# EAGLE design grabber-sensor (EAGLE 7.2.0)

## Sheet 1 of 12
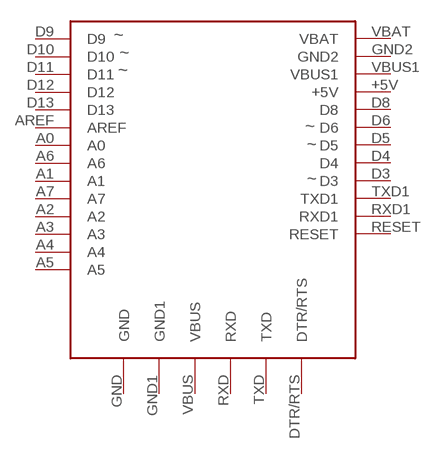
[diagram p0: schematic, sheet 1]

### Parts
U1_0_BRAIN  ADAFRUIT-PRO-TRINKET-5V-BOB  [ADAFRUIT-PRO-TRINKET-5V]

### Nets
+5V_0_BRAIN: U1_0_BRAIN.+5V ; also sheet 3,10
A0_0_BRAIN: U1_0_BRAIN.A0 ; also sheet 11
A1_0_BRAIN: U1_0_BRAIN.A1 ; also sheet 12
A2_0_BRAIN: U1_0_BRAIN.A2 ; also sheet 3
A3_0_BRAIN: U1_0_BRAIN.A3
A4_0_BRAIN: U1_0_BRAIN.A4
A5_0_BRAIN: U1_0_BRAIN.A5
A6_0_BRAIN: U1_0_BRAIN.A6
A7_0_BRAIN: U1_0_BRAIN.A7
AREF_0_BRAIN: U1_0_BRAIN.AREF
D3_0_BRAIN: U1_0_BRAIN.D3 ; also sheet 5
D4_0_BRAIN: U1_0_BRAIN.D4 ; also sheet 7
D5_0_BRAIN: U1_0_BRAIN.D5 ; also sheet 6
D6_0_BRAIN: U1_0_BRAIN.D6 ; also sheet 10
D8_0_BRAIN: U1_0_BRAIN.D8 ; also sheet 10
D9_0_BRAIN: U1_0_BRAIN.D9 ; also sheet 10
D10_0_BRAIN: U1_0_BRAIN.D10 ; also sheet 10
D11_0_BRAIN: U1_0_BRAIN.D11 ; also sheet 10
D12_0_BRAIN: U1_0_BRAIN.D12 ; also sheet 10
D13_0_BRAIN: U1_0_BRAIN.D13 ; also sheet 10
DTR/RTS_0_BRAIN: U1_0_BRAIN.DTR/RTS
GND_0_BRAIN: U1_0_BRAIN.GND U1_0_BRAIN.GND1 U1_0_BRAIN.GND2 ; also sheet 2,3,5,6,7,10,11,12
POS_1_BATTERY: U1_0_BRAIN.VBAT ; also sheet 2,5,6,10
RESET_0_BRAIN: U1_0_BRAIN.RESET
RXD1_0_BRAIN: U1_0_BRAIN.RXD1
RXD_0_BRAIN: U1_0_BRAIN.RXD
TXD1_0_BRAIN: U1_0_BRAIN.TXD1
TXD_0_BRAIN: U1_0_BRAIN.TXD
VBUS1_0_BRAIN: U1_0_BRAIN.VBUS1
VBUS_0_BRAIN: U1_0_BRAIN.VBUS

## Sheet 2 of 12
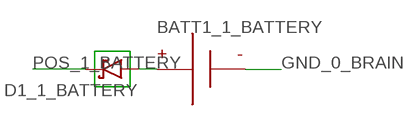
[diagram p1: schematic, sheet 2]

### Parts
BATT1_1_BATTERY  BATTERY-9V-VERTICAL  [BATTERY_9V_KEYSTONE_968]
D1_1_BATTERY  RESOLVED-DIODE-SCHOTTKY_TH-DO-41-AND-DO-204AL  [DIOAD1125W78L520D270_HS]

### Nets
GND_0_BRAIN: BATT1_1_BATTERY.N ; also sheet 1,3,5,6,7,10,11,12
N$1_1_BATTERY: BATT1_1_BATTERY.P D1_1_BATTERY.A
POS_1_BATTERY: D1_1_BATTERY.C ; also sheet 1,5,6,10

## Sheet 3 of 12
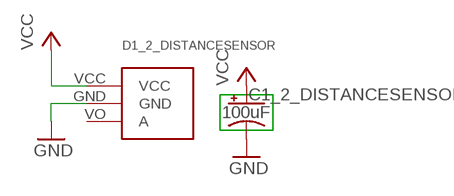
[diagram p2: schematic, sheet 3]

### Parts
C1_2_DISTANCESENSOR  100uF  RESOLVED-CAPACITOR-POL_TH-RADIAL_ALUMINUM_6.3MM  [CAPPRD250W80D630H1220P]
D1_2_DISTANCESENSOR  ANALOG_DISTANCE_SENSOR-GLUE  [ANALOG_DISTANCE_SENSOR_GLUE_MOUNT]

### Nets
+5V_0_BRAIN: C1_2_DISTANCESENSOR.1(+) D1_2_DISTANCESENSOR.VCC ; supply symbol labelled VCC ; also sheet 1,10
A2_0_BRAIN: D1_2_DISTANCESENSOR.VO(A) ; also sheet 1
GND_0_BRAIN: C1_2_DISTANCESENSOR.2(-) D1_2_DISTANCESENSOR.GND ; supply symbol labelled GND ; also sheet 1,2,5,6,7,10,11,12

## Sheet 4 of 12
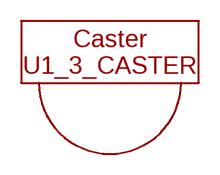
[diagram p3: schematic, sheet 4]

### Parts
U1_3_CASTER  CASTERADAFRUIT-3/4IN  [ADAFRUIT-3/4IN-CASTER]

## Sheet 5 of 12
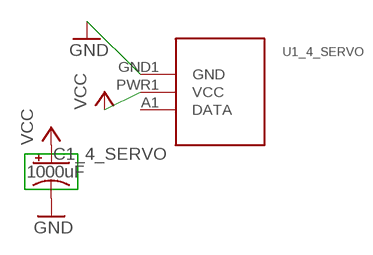
[diagram p4: schematic, sheet 5]

### Parts
C1_4_SERVO  1000uF  RESOLVED-CAPACITOR-POL_TH-RADIAL_ALUMINUM_10MM  [CAPPRD500W80D1000H2200P]
U1_4_SERVO  SERVO-MICRO_SIDE_GLUE  [SERVO_MICRO_SIDE_GLUE]

### Nets
D3_0_BRAIN: U1_4_SERVO.A1(DATA) ; also sheet 1
GND_0_BRAIN: C1_4_SERVO.2(-) U1_4_SERVO.GND1(GND) ; supply symbol labelled GND ; also sheet 1,2,3,6,7,10,11,12
POS_1_BATTERY: C1_4_SERVO.1(+) U1_4_SERVO.PWR1(VCC) ; supply symbol labelled VCC ; also sheet 1,2,6,10

## Sheet 6 of 12
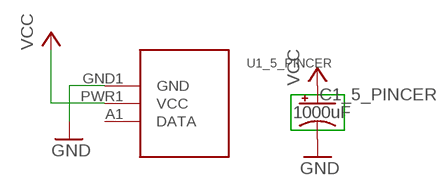
[diagram p5: schematic, sheet 6]

### Parts
C1_5_PINCER  1000uF  RESOLVED-CAPACITOR-POL_TH-RADIAL_ALUMINUM_10MM  [CAPPRD500W80D1000H2200P]
U1_5_PINCER  MICRO_GRIPPER  [MICRO_GRIPPER]

### Nets
D5_0_BRAIN: U1_5_PINCER.A1(DATA) ; also sheet 1
GND_0_BRAIN: C1_5_PINCER.2(-) U1_5_PINCER.GND1(GND) ; supply symbol labelled GND ; also sheet 1,2,3,5,7,10,11,12
POS_1_BATTERY: C1_5_PINCER.1(+) U1_5_PINCER.PWR1(VCC) ; supply symbol labelled VCC ; also sheet 1,2,5,10

## Sheet 7 of 12
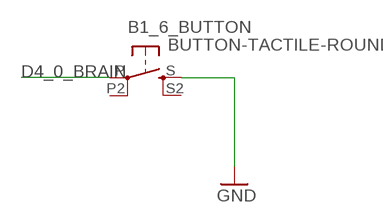
[diagram p6: schematic, sheet 7]

### Parts
B1_6_BUTTON  BUTTON-TACTILE-ROUND  [BUTTON-TACTILE-ROUND-ADAFRUIT1009]

### Nets
D4_0_BRAIN: B1_6_BUTTON.P ; also sheet 1
GND_0_BRAIN: B1_6_BUTTON.S ; supply symbol labelled GND ; also sheet 1,2,3,5,6,10,11,12
Unconnected: B1_6_BUTTON.P2(P1) B1_6_BUTTON.S2(S1)

## Sheet 8 of 12
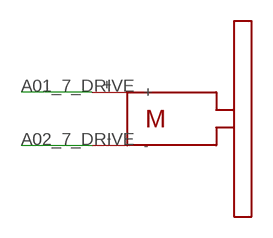
[diagram p7: schematic, sheet 8]

### Parts
R_7_DRIVE  SOLARBOTICS_GM2SPARKFUN_HOBBY  [SPARKFUN_HOBBY_MOTOR]

### Nets
A01_7_DRIVE: R_7_DRIVE.+ ; also sheet 10
A02_7_DRIVE: R_7_DRIVE.- ; also sheet 10

## Sheet 9 of 12
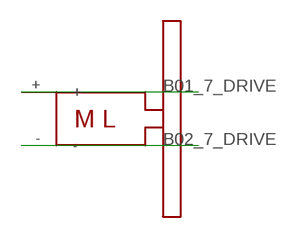
[diagram p8: schematic, sheet 9]

### Parts
L_7_DRIVE  SOLARBOTICS_GM2_LEFTSPARKFUN_HOBBY  [SPARKFUN_HOBBY_MOTOR_LEFT]

### Nets
B01_7_DRIVE: L_7_DRIVE.+ ; also sheet 10
B02_7_DRIVE: L_7_DRIVE.- ; also sheet 10

## Sheet 10 of 12
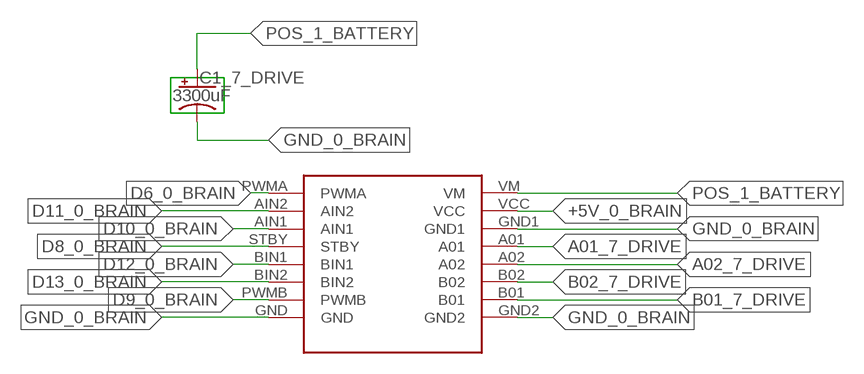
[diagram p9: schematic, sheet 10]

### Parts
C1_7_DRIVE  3300uF  RESOLVED-CAPACITOR-POL_TH-RADIAL_ALUMINUM_16MM  [CAPPRD750W80D1600H2200P]
DRVR_7_DRIVE  SPARKFUN_DUAL_MOTOR_DRIVER-BOB  [SPARKFUN_DUAL_MOTOR_DRIVER]

### Nets
+5V_0_BRAIN: DRVR_7_DRIVE.VCC ; also sheet 1,3
A01_7_DRIVE: DRVR_7_DRIVE.A01 ; also sheet 8
A02_7_DRIVE: DRVR_7_DRIVE.A02 ; also sheet 8
B01_7_DRIVE: DRVR_7_DRIVE.B01 ; also sheet 9
B02_7_DRIVE: DRVR_7_DRIVE.B02 ; also sheet 9
D6_0_BRAIN: DRVR_7_DRIVE.PWMA ; also sheet 1
D8_0_BRAIN: DRVR_7_DRIVE.STBY ; also sheet 1
D9_0_BRAIN: DRVR_7_DRIVE.PWMB ; also sheet 1
D10_0_BRAIN: DRVR_7_DRIVE.AIN1 ; also sheet 1
D11_0_BRAIN: DRVR_7_DRIVE.AIN2 ; also sheet 1
D12_0_BRAIN: DRVR_7_DRIVE.BIN1 ; also sheet 1
D13_0_BRAIN: DRVR_7_DRIVE.BIN2 ; also sheet 1
GND_0_BRAIN: C1_7_DRIVE.2(-) DRVR_7_DRIVE.GND DRVR_7_DRIVE.GND1 DRVR_7_DRIVE.GND2 ; also sheet 1,2,3,5,6,7,11,12
POS_1_BATTERY: C1_7_DRIVE.1(+) DRVR_7_DRIVE.VM ; also sheet 1,2,5,6

## Sheet 11 of 12
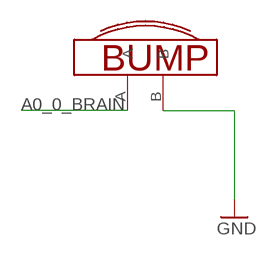
[diagram p10: schematic, sheet 11]

### Parts
U$2_8_BUMP  BUMP_SWITCH-MEDIUM-LEFT  [BUMP_SWITCH_OMRON_D2FLA]

### Nets
A0_0_BRAIN: U$2_8_BUMP.A ; also sheet 1
GND_0_BRAIN: U$2_8_BUMP.B ; supply symbol labelled GND ; also sheet 1,2,3,5,6,7,10,12

## Sheet 12 of 12
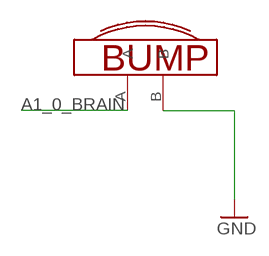
[diagram p11: schematic, sheet 12]

### Parts
U$2_9_BUMP_2  BUMP_SWITCH-MEDIUM-RIGHT  [BUMP_SWITCH_OMRON_D2FLA1]

### Nets
A1_0_BRAIN: U$2_9_BUMP_2.A ; also sheet 1
GND_0_BRAIN: U$2_9_BUMP_2.B ; supply symbol labelled GND ; also sheet 1,2,3,5,6,7,10,11

## Library data of the parts
B1_6_BUTTON = Components:BUTTON-TACTILE; DIST: Adafruit; DISTPN: 1009; HIERARCHY_NAME: button.B1
BATT1_1_BATTERY = Components:BATTERY; HIERARCHY_NAME: battery.BATT1
C1_2_DISTANCESENSOR = KoalaBuild:RESOLVED-CAPACITOR-POL_: Polarized capacitor; DATASHEET: http://industrial.panasonic.com/www-cgi/jvcr13pz.cgi?E+PZ+3+ABA0012+ECA1EM101+7+WW; DB: /Users/swanson/research/NVSL/src/with-git/gtron_devel/Gadgets/Tools/Koala/Koala/PartLibrary/Digikey/Capacitors-AluminumTH.csv; DEVICE: TH-RADIAL_ALUMINUM_6.3MM; DIST: Digikey; DISTPN: P5152-ND; HIERARCHY_NAME: distanceSensor.C1; IMAGE: http://media.digikey.com/Photos/Panasonic%20Photos/ECA-1EM101B.JPG; MFR: Panasonic Electronic Components; MIN_QTY: 1; MPN: ECA-1EM101; PACKAGE: CAPPRD250W80D630H1220P; PRICE: $0.25; SIZE: TH; STOCK: STOCK; TOL: 20%; VALUE_QUERY: >10uF; VOLTS: ( >= 5)V
C1_4_SERVO = KoalaBuild:RESOLVED-CAPACITOR-POL_: Polarized capacitor; DATASHEET: http://industrial.panasonic.com/www-cgi/jvcr13pz.cgi?E+PZ+3+ABA0012+ECA1EM102+7+WW; DB: /Users/swanson/research/NVSL/src/with-git/gtron_devel/Gadgets/Tools/Koala/Koala/PartLibrary/Digikey/Capacitors-AluminumTH.csv; DEVICE: TH-RADIAL_ALUMINUM_10MM; DIST: Digikey; DISTPN: P5156-ND; HIERARCHY_NAME: Servo.C1; IMAGE: http://media.digikey.com/Photos/Panasonic%20Photos/ECA-1AM102B.JPG; MFR: Panasonic Electronic Components; MIN_QTY: 1; MPN: ECA-1EM102; PACKAGE: CAPPRD500W80D1000H2200P; PRICE: $0.68; SIZE: TH; STOCK: STOCK; TOL: 20%; VALUE_QUERY: > 1000uF; VOLTS: ( >= 5)V
C1_5_PINCER = KoalaBuild:RESOLVED-CAPACITOR-POL_: Polarized capacitor; DATASHEET: http://industrial.panasonic.com/www-cgi/jvcr13pz.cgi?E+PZ+3+ABA0012+ECA1EM102+7+WW; DB: /Users/swanson/research/NVSL/src/with-git/gtron_devel/Gadgets/Tools/Koala/Koala/PartLibrary/Digikey/Capacitors-AluminumTH.csv; DEVICE: TH-RADIAL_ALUMINUM_10MM; DIST: Digikey; DISTPN: P5156-ND; HIERARCHY_NAME: Pincer.C1; IMAGE: http://media.digikey.com/Photos/Panasonic%20Photos/ECA-1AM102B.JPG; MFR: Panasonic Electronic Components; MIN_QTY: 1; MPN: ECA-1EM102; PACKAGE: CAPPRD500W80D1000H2200P; PRICE: $0.68; SIZE: TH; STOCK: STOCK; TOL: 20%; VALUE_QUERY: >1000uF; VOLTS: ( >= 5)V
C1_7_DRIVE = KoalaBuild:RESOLVED-CAPACITOR-POL_: Polarized capacitor; DATASHEET: http://industrial.panasonic.com/www-cgi/jvcr13pz.cgi?E+PZ+3+ABA0012+ECA1EM332+7+WW; DB: /Users/swanson/research/NVSL/src/with-git/gtron_devel/Gadgets/Tools/Koala/Koala/PartLibrary/Digikey/Capacitors-AluminumTH.csv; DEVICE: TH-RADIAL_ALUMINUM_16MM; DIST: Digikey; DISTPN: P5158-ND; HIERARCHY_NAME: drive.C1; IMAGE: http://media.digikey.com/Photos/Panasonic%20Photos/ECA-1CM472.jpg; MFR: Panasonic Electronic Components; MIN_QTY: 1; MPN: ECA-1EM332; PACKAGE: CAPPRD750W80D1600H2200P; PRICE: $1.13; SIZE: TH; STOCK: STOCK; TOL: 20%; VALUE_QUERY: >3000uF; VOLTS: ( >= 5)V
D1_1_BATTERY = KoalaBuild:RESOLVED-DIODE-SCHOTTKY_: Schottky diode; DATASHEET: http://www.st.com/web/en/resource/technical/document/datasheet/CD00001625.pdf; DB: /Users/swanson/research/NVSL/src/with-git/gtron_devel/Gadgets/Tools/Koala/Koala/PartLibrary/Digikey/Schottky-Diodes-TH.csv; DEVICE: TH-DO-41-AND-DO-204AL; DIST: Digikey; DISTPN: 497-4547-1-ND; HIERARCHY_NAME: battery.D1; IMAGE: http://media.digikey.com/photos/STMicro%20Photos/1N5819.JPG; IRECT: 1A; MFR: STMicroelectronics; MIN_QTY: 1; MPN: 1N5817; PACKAGE: DIOAD1125W78L520D270_HS; PRICE: $0.57; SIZE: TH; STOCK: STOCK; VALUE: 450mV; VREV: 20V
D1_2_DISTANCESENSOR = Components:ANALOG_DISTANCE_SENSOR; DIST: Pololu; DISTPN: 2450; HIERARCHY_NAME: distanceSensor.D1
DRVR_7_DRIVE = BOBs:SPARKFUN_DUAL_MOTOR_DRIVER: SF Dual Motor Driver; DIST: Sparkfun; DISTPN: 9457; HIERARCHY_NAME: drive.DRVR
L_7_DRIVE = Components:SOLARBOTICS_GM2_LEFT; HIERARCHY_NAME: drive.L
R_7_DRIVE = Components:SOLARBOTICS_GM2; HIERARCHY_NAME: drive.R
U1_0_BRAIN = BOBs:ADAFRUIT-PRO-TRINKET-5V: Adafruit Pro Trinket - 5V 16MHz; DIST: Adafruit; DISTPN: 2000; HIERARCHY_NAME: brain.U1
U1_3_CASTER = Components:CASTER; DIST: Adafruit; DISTPN: 1200; HIERARCHY_NAME: caster.u1
U1_4_SERVO = Components:SERVO: SM-S3317SR - Small Servo Continuous Rotation By SpringRC Technical Specifications: VCC: 4.8-6V Speed at 4.8V: 68 RPM Torque at 4.8V: 1.4 kg-cm (16.48 oz-in) Speed at 6V: 86 RPM Torque at 6V: 1.7 kg-cm (23.65 oz-in) Weight: 19g (0.67oz); DIST: Sparkfun; DISTPN: 9065; HIERARCHY_NAME: Servo.U1
U1_5_PINCER = Components:MICRO_GRIPPER; HIERARCHY_NAME: Pincer.U1
U$2_8_BUMP = Components:BUMP_SWITCH; DIST: Digikey; DISTPN: SW843-ND; HIERARCHY_NAME: bump.U$2
U$2_9_BUMP_2 = Components:BUMP_SWITCH; DIST: Digikey; DISTPN: SW842-ND; HIERARCHY_NAME: bump_2.U$2

## Board
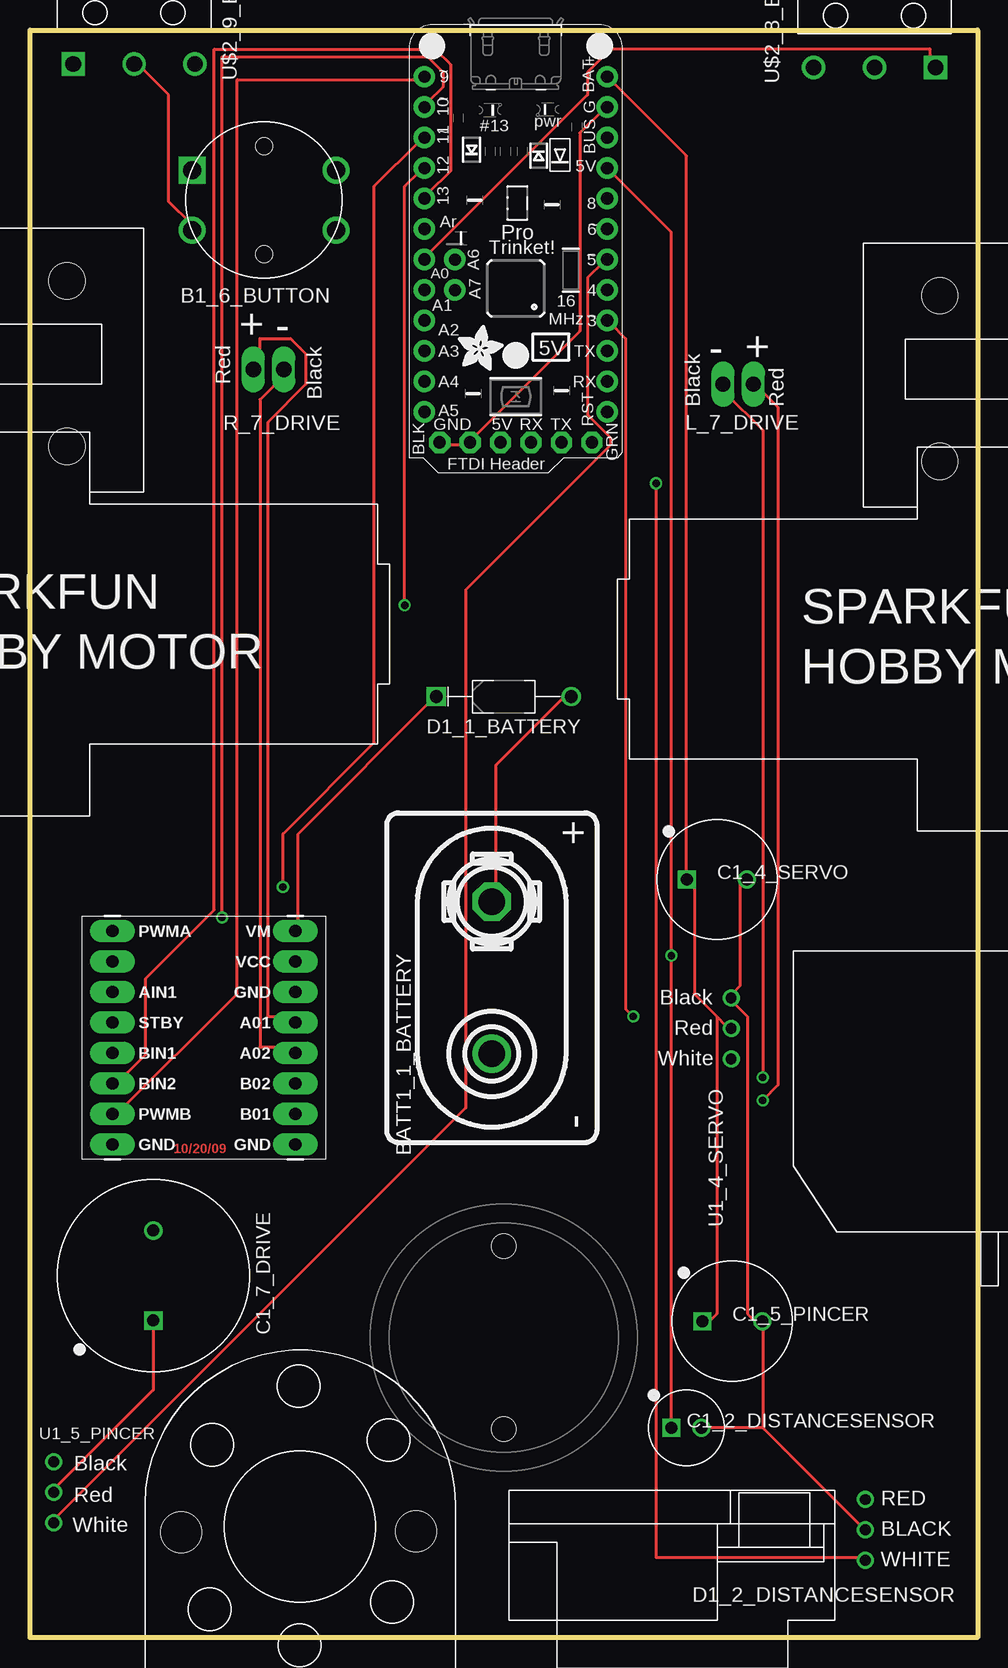
[diagram p12: board, top side]
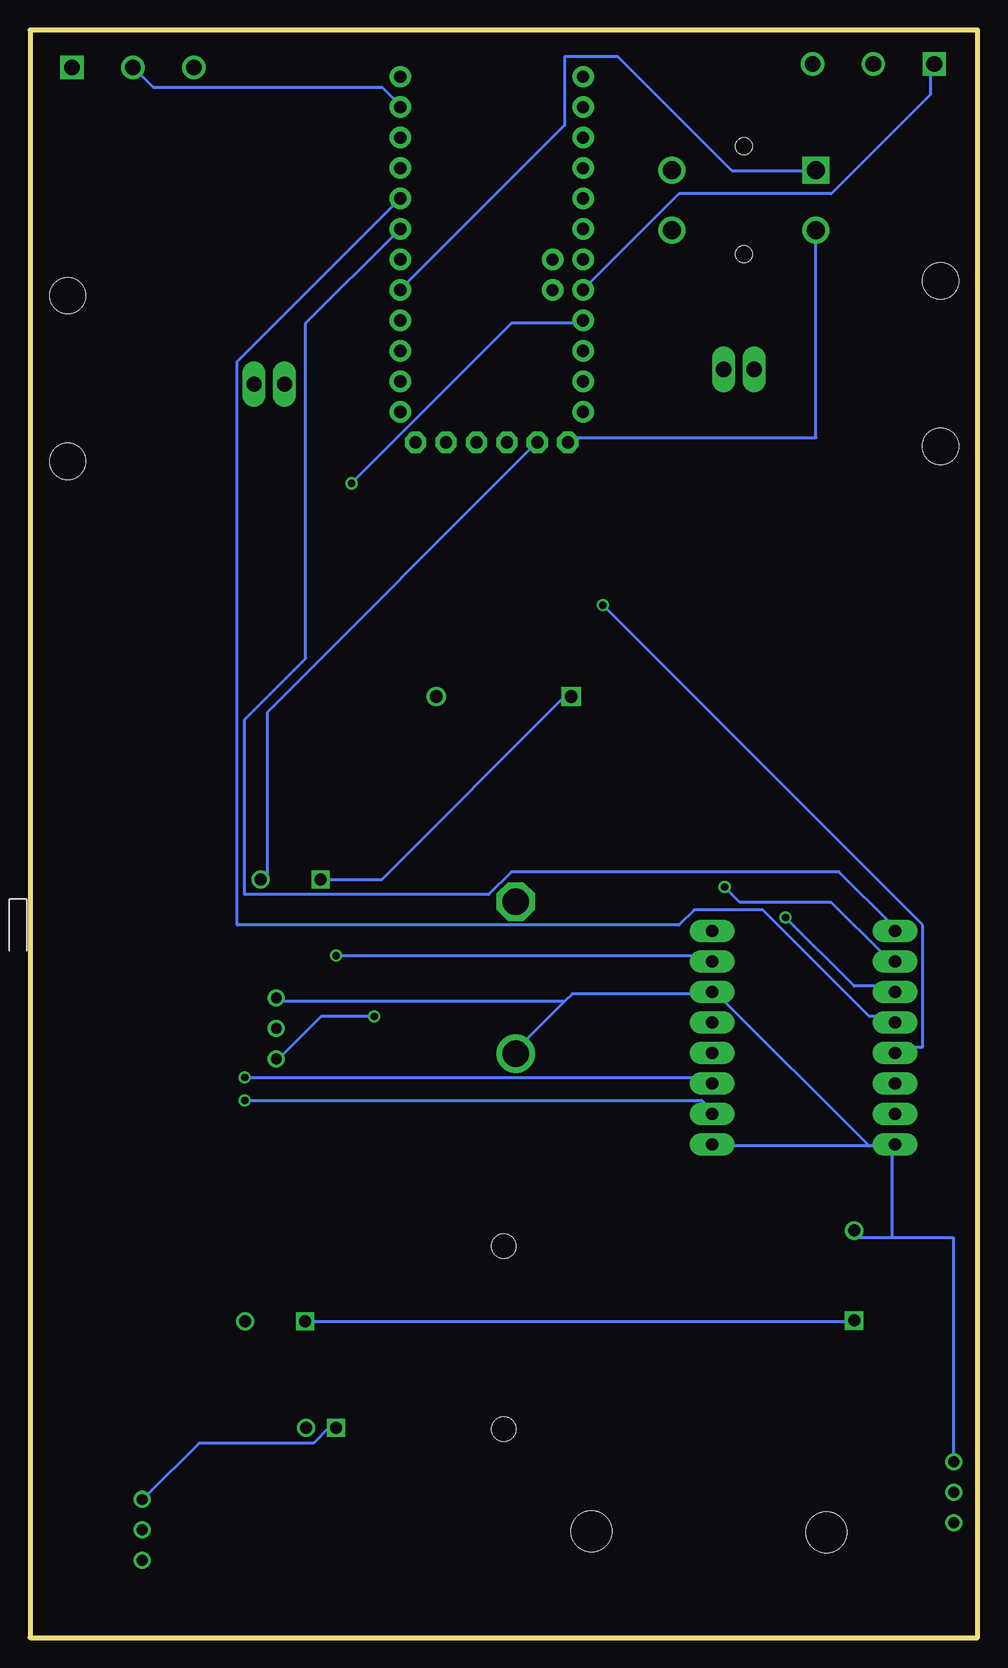
[diagram p13: board, bottom side, seen from below]

Size 79 x 134 mm. Coordinates in mm from the lower left corner, seen from the top.
Outline: 0,0 0,134 79,134 79,0 0,0
Copper layers (1*16): Top 0.035mm / dielectric 1.5mm / Bottom 0.035mm
Design rules "default": minimum track width 10mil, minimum drill 0.6mm, track to track 8mil, track to pad 8mil, pad to pad 8mil, via to via 8mil, smd to smd 8mil, copper to edge 40mil, drill to drill 8mil, minimum pad ring 10mil, minimum via ring 8mil, stop-mask expansion 4mil, vias tented up to drill 0mil, thermal gap 10mil

### Footprints (pad centres in the part's own frame; a part is rotated, then mirrored left to right if it is on the bottom)
BUTTON-TACTILE-ROUND-ADAFRUIT1009 = drill 1.5 square: P -6,2.5 | drill 1.5: P2 6,2.5; S -6,-2.5; S2 6,-2.5 | hole 1.4: 0,-4.5; 0,4.5
BATTERY_9V_KEYSTONE_968 = drill 2.2: N 6.35,0 | drill 2.2 octagon: P -6.35,0
CAPPRD250W80D630H1220P = drill 1 pad 1.5 square: 1 -1.25,0 | drill 1 pad 1.5: 2 1.25,0
CAPPRD500W80D1000H2200P = drill 1 pad 1.5 square: 1 -2.5,0 | drill 1 pad 1.5: 2 2.5,0
CAPPRD750W80D1600H2200P = drill 1 pad 1.5 square: 1 -3.75,0 | drill 1 pad 1.5: 2 3.75,0
DIOAD1125W78L520D270_HS = drill 1.06 pad 1.59: A 5.625,0 | drill 1.06 pad 1.59 square: C -5.625,0
ANALOG_DISTANCE_SENSOR_GLUE_MOUNT = drill 0.9: GND -2.54,0.508; VCC -2.54,-2.032; VO -2.54,3.048
SPARKFUN_DUAL_MOTOR_DRIVER = drill 1.016 pad 1.88 long: A01 7.62,1.27; A02 7.62,-1.27; AIN1 -7.62,3.81; AIN2 -7.62,6.35; B01 7.62,-6.35; B02 7.62,-3.81; BIN1 -7.62,-1.27; BIN2 -7.62,-3.81; GND -7.62,-8.89; GND1 7.62,3.81; GND2 7.62,-8.89; PWMA -7.62,8.89; PWMB -7.62,-6.35; STBY -7.62,1.27; VCC 7.62,6.35; VM 7.62,8.89
SPARKFUN_HOBBY_MOTOR_LEFT = drill 1.27 long: + -40.64,-1.27; - -43.18,-1.27 | hole 3: -25.1,-7.7; -25.1,6.1
SPARKFUN_HOBBY_MOTOR = drill 1.27 long: + 40.64,-1.27; - 43.18,-1.27 | hole 3: 25.1,-7.7; 25.1,6.1
ADAFRUIT-PRO-TRINKET-5V = drill 1.016 pad 1.778: +5V 7.62,24.13; A0 -7.62,16.51; A1 -7.62,13.97; A2 -7.62,11.43; A3 -7.62,8.89; A4 -7.62,6.35; A5 -7.62,3.81; AREF -7.62,19.05; D3 7.62,11.43; D4 7.62,13.97; D5 7.62,16.51; D6 7.62,19.05; D8 7.62,21.59; D9 -7.62,31.75; D10 -7.62,29.21; D11 -7.62,26.67; D12 -7.62,24.13; D13 -7.62,21.59; GND2 7.62,29.21; RESET 7.62,3.81; RXD1 7.62,6.35; TXD1 7.62,8.89; VBAT 7.62,31.75; VBUS1 7.62,26.67 | drill 1 pad 1.778: A6 -5.08,16.51; A7 -5.08,13.97 | drill 1.016 pad 1.778 octagon: DTR/RTS 6.35,1.27; GND -6.35,1.27; GND1 -3.81,1.27; RXD 1.27,1.27; TXD 3.81,1.27; VBUS -1.27,1.27
ADAFRUIT-3/4IN-CASTER = hole 2: -7.62,0; 7.62,0
SERVO_MICRO_SIDE_GLUE = drill 0.9: A1 8.97,-5.2; GND1 3.89,-5.2; PWR1 6.43,-5.2
MICRO_GRIPPER = drill 0.9: A1 -20.32,25.4; GND1 -20.32,30.48; PWR1 -20.32,27.94 | hole 3.4: -9.7,24.6; 9.9,24.7
BUMP_SWITCH_OMRON_D2FLA = drill 1.3 square: A 5.08,-2.8 | drill 1.3: B 0,-2.8; NC -5.08,-2.8
BUMP_SWITCH_OMRON_D2FLA1 = drill 1.3 square: A -5.08,-2.8 | drill 1.3: B 0,-2.8; NC 5.08,-2.8

### Placement (x,y rotation side)
B1_6_BUTTON  19.5,119.83 0 top
BATT1_1_BATTERY  38.5,55 270 top
C1_2_DISTANCESENSOR  54.74,17.47 0 top
C1_4_SERVO  57.28,63.19 0 top
C1_5_PINCER  58.55,26.36 0 top
C1_7_DRIVE  10.29,30.17 90 top
D1_1_BATTERY  39.5,78.43 0 top
D1_2_DISTANCESENSOR  67.11,9.48 180 top
DRVR_7_DRIVE  14.5,50 0 top
L_7_DRIVE  100.96,105.75 0 top
R_7_DRIVE  -22.02,106.99 0 top
U1_0_BRAIN  40.5,98.36 0 top
U1_3_CASTER  39.5,25 270 top
U1_4_SERVO  63.67,57.21 270 top
U1_5_PINCER  22.29,-15.84 0 top
U$2_8_BUMP  70.43,133.69 0 top
U$2_9_BUMP_2  8.69,133.95 0 top

### Tracks (layer width: path | path; a pad name or v marks a point on that pad's centre or on a via)
+5V_0_BRAIN  (via drill 0.6)
  Top 0.254: U1_0_BRAIN.+5V 48.39,122.25 53.47,117.16 v53.47,56.84 53.47,17.47 C1_2_DISTANCESENSOR.1
  Bottom 0.254: D1_2_DISTANCESENSOR.VCC 69.34,11.76 64.9,16.2 55.38,16.2 54.11,17.47 C1_2_DISTANCESENSOR.1 | v53.47,56.84 22.36,56.84 DRVR_7_DRIVE.VCC
A0_0_BRAIN
  Top 0.254: U1_0_BRAIN.A0 33.15,115.26 46.48,128.59 46.48,130.5 48.39,132.41 75.06,132.41 75.06,131.13 U$2_8_BUMP.A
A1_0_BRAIN
  Bottom 0.254: U1_0_BRAIN.A1 32.52,112.72 24.89,120.34 12.2,120.34 3.94,128.59 3.94,131.13 U$2_9_BUMP_2.A
A01_7_DRIVE
  Top 0.254: DRVR_7_DRIVE.A01 21.72,51.76 19.82,51.76 19.82,101.29 22.99,104.47 22.99,107 21.72,108.28 19.18,108.28 19.18,105.73 R_7_DRIVE.+
A2_0_BRAIN  (via drill 0.6)
  Top 0.254: v52.2,96.21 52.2,6.67 69.34,6.67 D1_2_DISTANCESENSOR.VO
  Bottom 0.254: v52.2,96.21 38.87,109.55 33.15,109.55 U1_0_BRAIN.A2
A02_7_DRIVE
  Top 0.254: DRVR_7_DRIVE.A02 21.72,49.22 19.18,49.22 19.18,103.19 21.09,105.1 R_7_DRIVE.-
B01_7_DRIVE  (via drill 0.6)
  Top 0.254: v61.09,44.77 62.36,46.05 62.36,102.56 60.45,104.47 L_7_DRIVE.+
  Bottom 0.254: v61.09,44.77 22.99,44.77 22.36,44.14 DRVR_7_DRIVE.B01
B02_7_DRIVE  (via drill 0.6)
  Top 0.254: v61.09,46.68 61.09,100.66 57.91,103.83 57.91,104.47 L_7_DRIVE.-
  Bottom 0.254: v61.09,46.68 22.36,46.68 DRVR_7_DRIVE.B02
D3_0_BRAIN  (via drill 0.6)
  Top 0.254: v50.3,51.76 49.66,52.39 49.66,108.28 48.39,109.55 U1_0_BRAIN.D3
  Bottom 0.254: v50.3,51.76 54.74,51.76 57.91,48.59 U1_4_SERVO.A1
D4_0_BRAIN
  Bottom 0.254: U1_0_BRAIN.D4 47.76,112.72 34.42,126.06 34.42,131.77 29.98,131.77 20.45,122.25 14.1,122.25 B1_6_BUTTON.P
D5_0_BRAIN
  Top 0.254: U1_5_PINCER.A1 2.03,9.85 36.33,44.14 36.33,87.32 48.39,99.38 48.39,100.02 46.48,101.92 46.48,113.35 47.76,114.62 U1_0_BRAIN.D5
D6_0_BRAIN
  Bottom 0.254: U1_0_BRAIN.D6 48.39,117.16 56.01,109.55 56.01,81.61 61.09,76.53 61.09,61.92 40.77,61.92 38.87,63.83 11.56,63.83 7.12,59.38 DRVR_7_DRIVE.PWMA
D8_0_BRAIN
  Bottom 0.254: U1_0_BRAIN.D8 48.39,119.7 61.73,106.37 61.73,59.38 24.89,59.38 23.62,60.65 17.91,60.65 9.02,51.76 7.12,51.76 DRVR_7_DRIVE.STBY
D9_0_BRAIN
  Top 0.254: U1_0_BRAIN.D9 32.52,129.87 17.27,129.87 17.27,53.66 7.12,43.5 DRVR_7_DRIVE.PWMB
D10_0_BRAIN  (via drill 0.6)
  Top 0.254: v16,60.02 16,131.77 33.15,131.77 34.42,130.5 34.42,129.23 33.15,127.96 U1_0_BRAIN.D10
  Bottom 0.254: v16,60.02 10.29,54.3 7.12,54.3 DRVR_7_DRIVE.AIN1
D11_0_BRAIN  (via drill 0.6)
  Top 0.254: v21.09,62.55 21.09,67 28.7,74.62 28.7,120.97 32.52,124.78 U1_0_BRAIN.D11
  Bottom 0.254: v21.09,62.55 19.82,61.28 12.2,61.28 7.75,56.84 7.12,56.84 DRVR_7_DRIVE.AIN2
D12_0_BRAIN  (via drill 0.6)
  Top 0.254: v31.24,86.05 31.24,120.97 32.52,122.25 U1_0_BRAIN.D12
  Bottom 0.254: v31.24,86.05 4.58,59.38 4.58,49.22 6.48,49.22 DRVR_7_DRIVE.BIN1
D13_0_BRAIN
  Top 0.254: U1_0_BRAIN.D13 33.15,120.34 35.05,122.25 35.05,131.13 33.78,132.41 15.37,132.41 15.37,60.65 9.66,54.94 9.66,48.59 7.12,46.05 DRVR_7_DRIVE.BIN2
GND_0_BRAIN
  Top 0.254: U$2_9_BUMP_2.B 9.02,131.13 11.56,128.59 11.56,119.7 13.46,117.8 B1_6_BUTTON.S | U1_0_BRAIN.GND 34.42,99.38 36.33,99.38 U1_0_BRAIN.GND1 36.96,100.02 45.85,108.91 45.85,125.42 47.76,127.33 U1_0_BRAIN.GND2 | 61.09,17.47 69.34,9.22 D1_2_DISTANCESENSOR.GND | 61.09,17.47 61.09,26.36 C1_5_PINCER.2 60.45,26.36 59.82,26.99 59.82,51.76 58.55,53.03 U1_4_SERVO.GND1 58.55,53.66 59.19,54.3 59.19,63.19 C1_4_SERVO.2 | 61.09,17.47 C1_2_DISTANCESENSOR.2
  Bottom 0.254: U1_0_BRAIN.GND2 48.39,127.96 49.66,129.23 68.71,129.23 69.98,130.5 U$2_8_BUMP.B | B1_6_BUTTON.S 13.46,117.16 13.46,100.02 33.78,100.02 U1_0_BRAIN.GND | 7.12,33.34 10.29,33.34 C1_7_DRIVE.2 | 7.12,33.34 2.03,33.34 2.03,14.93 U1_5_PINCER.GND1 | 7.12,33.34 7.12,40.97 | 7.12,40.97 9.02,40.97 | 9.02,40.97 21.72,40.97 DRVR_7_DRIVE.GND2 | 7.12,40.97 DRVR_7_DRIVE.GND | 9.02,40.97 21.72,53.66 DRVR_7_DRIVE.GND1 22.36,53.66 33.78,53.66 34.42,53.03 | 34.42,53.03 38.23,49.22 BATT1_1_BATTERY.N | 34.42,53.03 57.91,53.03 U1_4_SERVO.GND1 | U1_0_BRAIN.GND1 36.96,99.38 59.19,77.16 59.19,63.19 C1_4_SERVO.2
N$1_1_BATTERY
  Top 0.254: D1_1_BATTERY.A 44.58,78.43 38.87,72.72 38.87,61.92 BATT1_1_BATTERY.P
POS_1_BATTERY
  Top 0.254: D1_1_BATTERY.C 33.78,78.43 22.36,67 22.36,59.38 DRVR_7_DRIVE.VM | C1_7_DRIVE.1 10.29,20.65 2.03,12.39 U1_5_PINCER.PWR1 | 57.28,51.76 55.38,53.66 55.38,63.19 C1_4_SERVO.1 54.74,63.19 54.74,123.52 48.39,129.87 U1_0_BRAIN.VBAT | 57.28,51.76 57.91,51.12 U1_4_SERVO.PWR1 | 57.28,51.76 57.28,26.99 56.64,26.36 C1_5_PINCER.1
  Bottom 0.254: C1_5_PINCER.1 10.29,26.36 C1_7_DRIVE.1 | C1_4_SERVO.1 49.66,63.19 34.42,78.43 D1_1_BATTERY.C